# EAGLE design power_distribution (EAGLE 8.0.0)
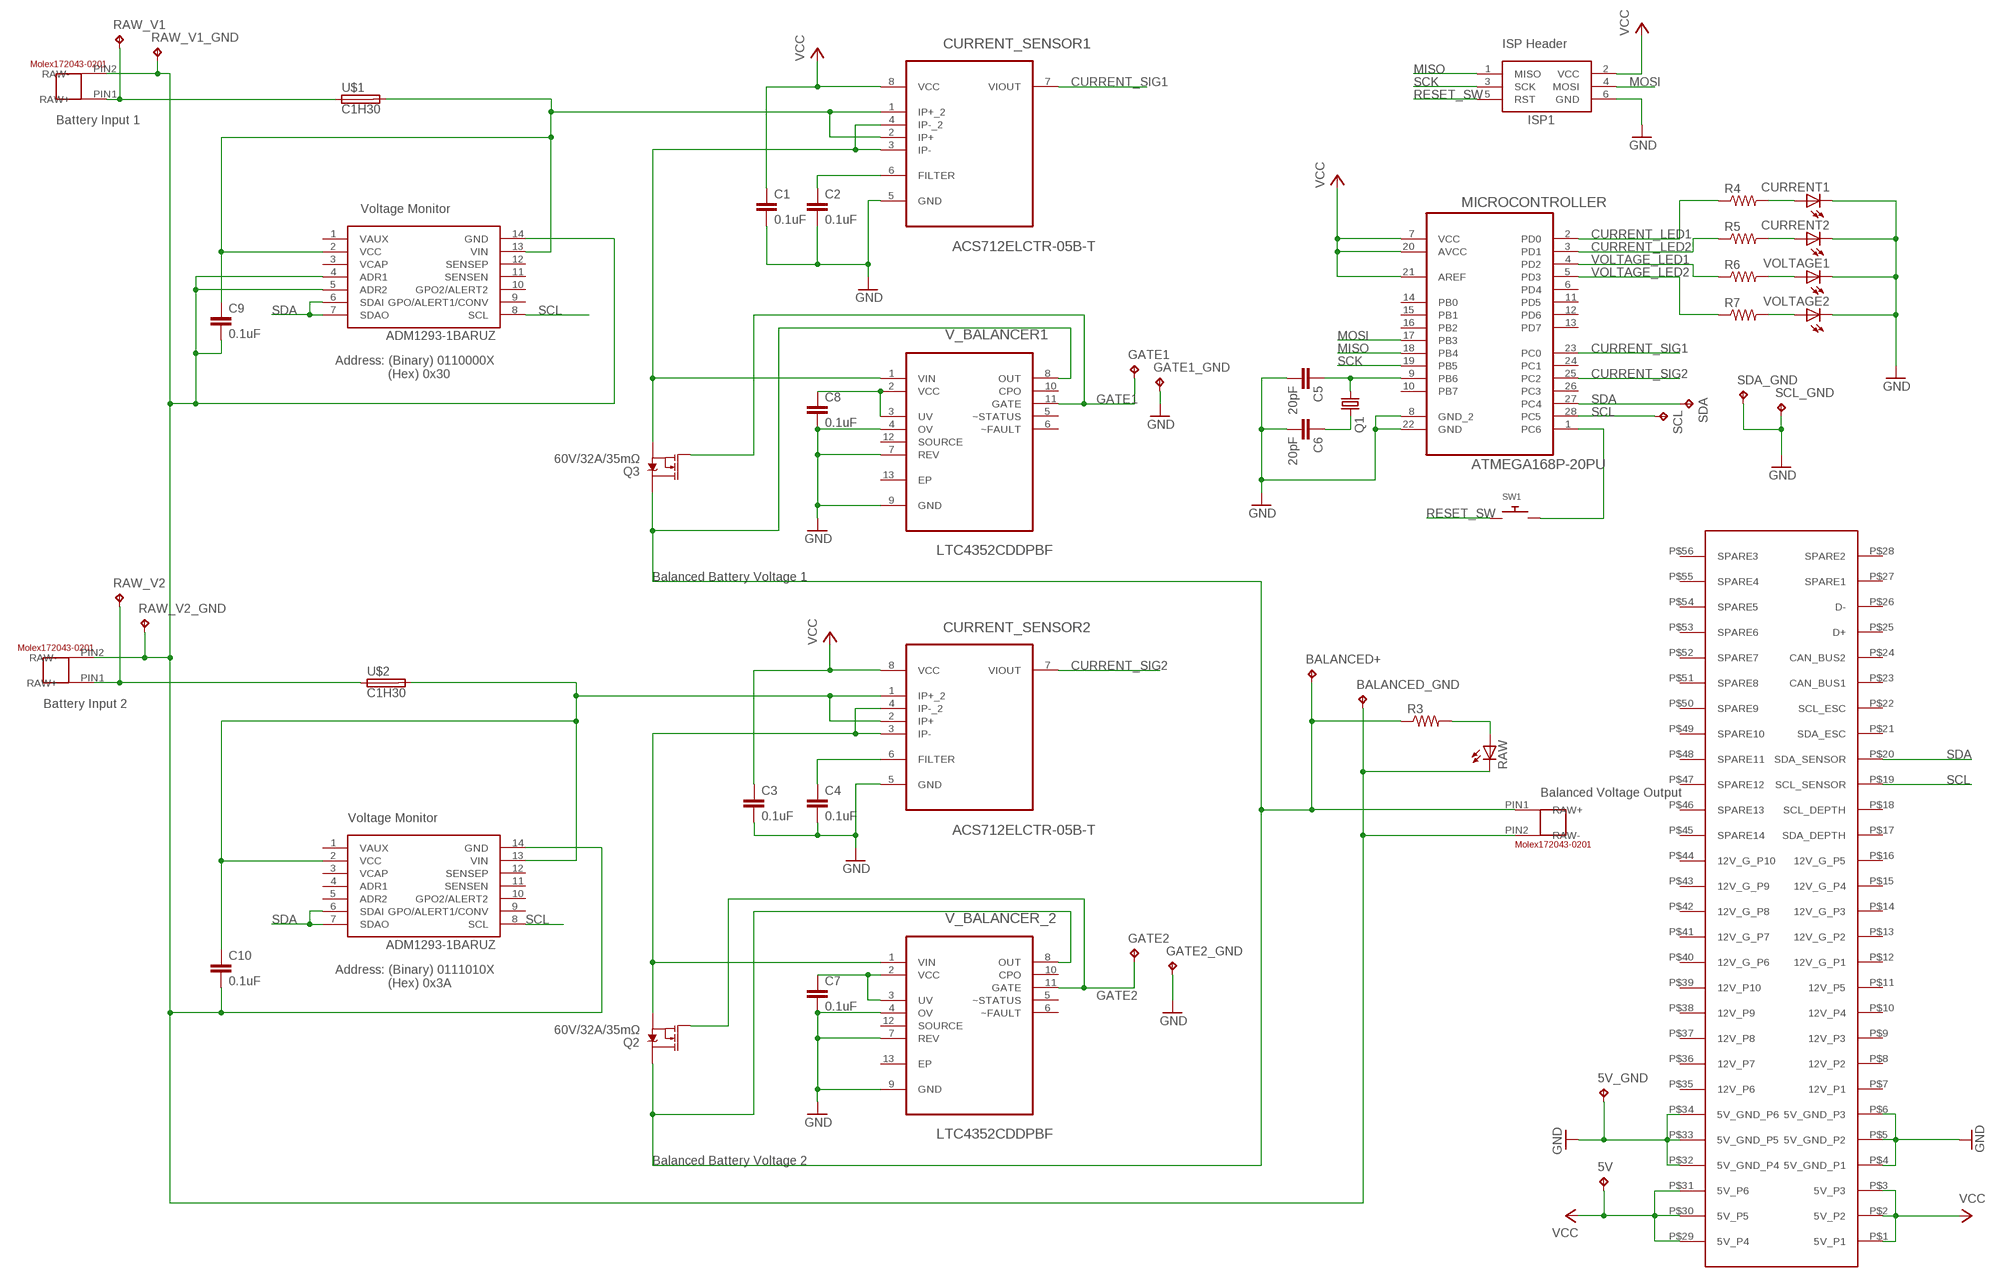
[diagram p0: schematic, sheet 1]

## Parts
5V  TPPAD1-13  [P1-13]
5V_GND  TPPAD1-13  [P1-13]
BALANCED+  TPPAD1-13  [P1-13]
BALANCED_GND  TPPAD1-13  [P1-13]
C1  0.1uF  0.1UF-KIT-EZ-50V-20%  [CAP-PTH-SMALL-KIT]
C2  0.1uF  0.1UF-KIT-EZ-50V-20%  [CAP-PTH-SMALL-KIT]
C3  0.1uF  0.1UF-KIT-EZ-50V-20%  [CAP-PTH-SMALL-KIT]
C4  0.1uF  0.1UF-KIT-EZ-50V-20%  [CAP-PTH-SMALL-KIT]
C5  20pF  0.1UF-KIT-EZ-50V-20%  [CAP-PTH-SMALL-KIT]
C6  20pF  0.1UF-KIT-EZ-50V-20%  [CAP-PTH-SMALL-KIT]
C7  0.1uF  0.1UF-KIT-EZ-50V-20%  [CAP-PTH-SMALL-KIT]
C8  0.1uF  0.1UF-KIT-EZ-50V-20%  [CAP-PTH-SMALL-KIT]
C9  0.1uF  0.1UF-KIT-EZ-50V-20%  [CAP-PTH-SMALL-KIT]
C10  0.1uF  0.1UF-KIT-EZ-50V-20%  [CAP-PTH-SMALL-KIT]
CURRENT1  LED3MM  [LED3MM]
CURRENT2  LED3MM  [LED3MM]
CURRENT_SENSOR1  ACS712ELCTR-05B-T  [SOIC127P600X175-8N]
CURRENT_SENSOR2  ACS712ELCTR-05B-T  [SOIC127P600X175-8N]
GATE1  TPPAD1-13  [P1-13]
GATE1_GND  TPPAD1-13  [P1-13]
GATE2  TPPAD1-13  [P1-13]
GATE2_GND  TPPAD1-13  [P1-13]
INPUT1  MOLEX172043-0201  [MOLEX172043-0201]
INPUT2  MOLEX172043-0201  [MOLEX172043-0201]
ISP1  AVRISP-6  [AVRISP]
MICROCONTROLLER  ATMEGA168P-20PU  [DIP254P762X457-28]
OUTPUT  MOLEX172043-0201  [MOLEX172043-0201]
Q1  CRYSTALHC49U-V  [HC49U-V]
Q2  60V/32A/35mΩ  MOSFET-NCH-FQP30N06L  [TO220V]
Q3  60V/32A/35mΩ  MOSFET-NCH-FQP30N06L  [TO220V]
R3  R-US_0207/12  [0207/12]
R4  R-US_0207/12  [0207/12]
R5  R-US_0207/12  [0207/12]
R6  R-US_0207/12  [0207/12]
R7  R-US_0207/12  [0207/12]
RAW  LED3MM  [LED3MM]
RAW_V1  TPPAD1-13  [P1-13]
RAW_V1_GND  TPPAD1-13  [P1-13]
RAW_V2  TPPAD1-13  [P1-13]
RAW_V2_GND  TPPAD1-13  [P1-13]
SCL  TPPAD1-13  [P1-13]
SCL_GND  TPPAD1-13  [P1-13]
SDA  TPPAD1-13  [P1-13]
SDA_GND  TPPAD1-13  [P1-13]
SW1  SWITCH_PUSHBUTTONEVQ-PE  [TACT_PANA-EVQ]
U$1  C1H30  [C1H30]
U$2  C1H30  [C1H30]
U$3  1-530844-7  [1-530844-7]
U$4  ADM1293  [SOP65P640X120-14N]
U$5  ADM1293  [SOP65P640X120-14N]
V_BALANCER1  LTC4352CDDPBF  [DFN300X300X80-13N]
V_BALANCER_2  LTC4352CDDPBF  [DFN300X300X80-13N]
VOLTAGE1  LED3MM  [LED3MM]
VOLTAGE2  LED3MM  [LED3MM]

## Nets
CURRENT_LED1: MICROCONTROLLER.2(PD0) R4.1
CURRENT_LED2: MICROCONTROLLER.3(PD1) R5.1
CURRENT_SIG1: CURRENT_SENSOR1.7(VIOUT) MICROCONTROLLER.23(PC0)
CURRENT_SIG2: CURRENT_SENSOR2.7(VIOUT) MICROCONTROLLER.25(PC2)
GATE1: GATE1.TP Q3.1(G) V_BALANCER1.11(GATE)
GATE2: GATE2.TP Q2.1(G) V_BALANCER_2.11(GATE)
GND: 5V_GND.TP C1.2 C2.2 C3.2 C4.2 C5.2 C6.2 C7.2 C8.2 CURRENT1.K(C) CURRENT2.K(C) CURRENT_SENSOR1.5(GND) CURRENT_SENSOR2.5(GND) GATE1_GND.TP GATE2_GND.TP ISP1.6(GND) MICROCONTROLLER.8(GND_2) MICROCONTROLLER.22(GND) SCL_GND.TP SDA_GND.TP U$3.P$4(5V_GND_P1) U$3.P$5(5V_GND_P2) U$3.P$6(5V_GND_P3) U$3.P$32(5V_GND_P4) U$3.P$33(5V_GND_P5) U$3.P$34(5V_GND_P6) V_BALANCER1.4(OV) V_BALANCER1.7(REV) V_BALANCER1.9(GND) V_BALANCER_2.4(OV) V_BALANCER_2.7(REV) V_BALANCER_2.9(GND) VOLTAGE1.K(C) VOLTAGE2.K(C)
MISO: ISP1.1(MISO) MICROCONTROLLER.18(PB4)
MOSI: ISP1.4(MOSI) MICROCONTROLLER.17(PB3)
N$1: C9.1 CURRENT_SENSOR1.1(IP+_2) CURRENT_SENSOR1.2(IP+) U$1.P$2 U$4.2(VCC) U$4.13(VIN)
N$2: C5.1 MICROCONTROLLER.9(PB6) Q1.1
N$3: C7.1 V_BALANCER_2.2(VCC) V_BALANCER_2.3(UV)
N$4: C6.1 Q1.2
N$5: CURRENT_SENSOR1.3(IP-) CURRENT_SENSOR1.4(IP-_2) Q3.3(S) V_BALANCER1.1(VIN)
N$7: CURRENT1.A R4.2
N$8: R3.2 RAW.A
N$9: C8.1 V_BALANCER1.2(VCC) V_BALANCER1.3(UV)
N$10: INPUT1.PIN1(RAW+) RAW_V1.TP U$1.P$1
N$11: C10.1 CURRENT_SENSOR2.1(IP+_2) CURRENT_SENSOR2.2(IP+) U$2.P$2 U$5.2(VCC) U$5.13(VIN)
N$13: CURRENT2.A R5.2
N$14: C2.1 CURRENT_SENSOR1.6(FILTER)
N$15: R6.2 VOLTAGE1.A
N$16: INPUT2.PIN1(RAW+) RAW_V2.TP U$2.P$1
N$17: R7.2 VOLTAGE2.A
N$18: C4.1 CURRENT_SENSOR2.6(FILTER)
N$19: BALANCED_GND.TP C9.2 C10.2 INPUT1.PIN2(RAW-) INPUT2.PIN2(RAW-) OUTPUT.PIN2(RAW-) RAW.K(C) RAW_V1_GND.TP RAW_V2_GND.TP U$4.4(ADR1) U$4.5(ADR2) U$4.14(GND) U$5.14(GND)
N$26: BALANCED+.TP OUTPUT.PIN1(RAW+) Q2.2(D) Q3.2(D) R3.1 V_BALANCER1.8(OUT) V_BALANCER_2.8(OUT)
N$27: MICROCONTROLLER.1(PC6) SW1.P$2
RESET_SW: ISP1.5(RST) SW1.P$1
SCK: ISP1.3(SCK) MICROCONTROLLER.19(PB5)
SCL: MICROCONTROLLER.28(PC5) SCL.TP U$3.P$19(SCL_SENSOR) U$4.8(SCL) U$5.8(SCL)
SDA: MICROCONTROLLER.27(PC4) SDA.TP U$3.P$20(SDA_SENSOR) U$4.6(SDAI) U$4.7(SDAO) U$5.6(SDAI) U$5.7(SDAO)
VCC: 5V.TP C1.1 C3.1 CURRENT_SENSOR1.8(VCC) CURRENT_SENSOR2.8(VCC) ISP1.2(VCC) MICROCONTROLLER.7(VCC) MICROCONTROLLER.20(AVCC) MICROCONTROLLER.21(AREF) U$3.P$1(5V_P1) U$3.P$2(5V_P2) U$3.P$3(5V_P3) U$3.P$29(5V_P4) U$3.P$30(5V_P5) U$3.P$31(5V_P6)
VOLTAGE_IN2: CURRENT_SENSOR2.3(IP-) CURRENT_SENSOR2.4(IP-_2) Q2.3(S) V_BALANCER_2.1(VIN)
VOLTAGE_LED1: MICROCONTROLLER.4(PD2) R6.1
VOLTAGE_LED2: MICROCONTROLLER.5(PD3) R7.1
Unconnected: MICROCONTROLLER.6(PD4) MICROCONTROLLER.10(PB7) MICROCONTROLLER.11(PD5) MICROCONTROLLER.12(PD6) MICROCONTROLLER.13(PD7) MICROCONTROLLER.14(PB0) MICROCONTROLLER.15(PB1) MICROCONTROLLER.16(PB2) MICROCONTROLLER.24(PC1) MICROCONTROLLER.26(PC3) U$3.P$7(12V_P1) U$3.P$8(12V_P2) U$3.P$9(12V_P3) U$3.P$10(12V_P4) U$3.P$11(12V_P5) U$3.P$12(12V_G_P1) U$3.P$13(12V_G_P2) U$3.P$14(12V_G_P3) U$3.P$15(12V_G_P4) U$3.P$16(12V_G_P5) U$3.P$17(SDA_DEPTH) U$3.P$18(SCL_DEPTH) U$3.P$21(SDA_ESC) U$3.P$22(SCL_ESC) U$3.P$23(CAN_BUS1) U$3.P$24(CAN_BUS2) U$3.P$25(D+) U$3.P$26(D-) U$3.P$27(SPARE1) U$3.P$28(SPARE2) U$3.P$35(12V_P6) U$3.P$36(12V_P7) U$3.P$37(12V_P8) U$3.P$38(12V_P9) U$3.P$39(12V_P10) U$3.P$40(12V_G_P6) U$3.P$41(12V_G_P7) U$3.P$42(12V_G_P8) U$3.P$43(12V_G_P9) U$3.P$44(12V_G_P10) U$3.P$45(SPARE14) U$3.P$46(SPARE13) U$3.P$47(SPARE12) U$3.P$48(SPARE11) U$3.P$49(SPARE10) U$3.P$50(SPARE9) U$3.P$51(SPARE8) U$3.P$52(SPARE7) U$3.P$53(SPARE6) U$3.P$54(SPARE5) U$3.P$55(SPARE4) U$3.P$56(SPARE3) U$4.1(VAUX) U$4.3(VCAP) U$4.9(GPO/ALERT1/CONV) U$4.10(GPO2/ALERT2) U$4.11(SENSEN) U$4.12(SENSEP) U$5.1(VAUX) U$5.3(VCAP) U$5.4(ADR1) U$5.5(ADR2) U$5.9(GPO/ALERT1/CONV) U$5.10(GPO2/ALERT2) U$5.11(SENSEN) U$5.12(SENSEP) V_BALANCER1.5(~STATUS) V_BALANCER1.6(~FAULT) V_BALANCER1.10(CPO) V_BALANCER1.12(SOURCE) V_BALANCER1.13(EP) V_BALANCER_2.5(~STATUS) V_BALANCER_2.6(~FAULT) V_BALANCER_2.10(CPO) V_BALANCER_2.12(SOURCE) V_BALANCER_2.13(EP)

## Notes on the sheet
- ISP Header
- Battery Input 1
- Voltage Monitor
- ADM1293-1BARUZ
- Address: (Binary) 0110000X
                 (Hex) 0x30
- Balanced Battery Voltage 1
- Battery Input 2
- Balanced Voltage Output
- Voltage Monitor
- ADM1293-1BARUZ
- Address: (Binary) 0111010X
                 (Hex) 0x3A
- Balanced Battery Voltage 2

## Library data of the parts
5V 5V_GND BALANCED+ BALANCED_GND GATE1 GATE1_GND GATE2 GATE2_GND RAW_V1 RAW_V1_GND RAW_V2 RAW_V2_GND SCL SCL_GND SDA SDA_GND = testpad:TP: Test pad
C1-C4 C7-C10 = SparkFun-Capacitors:0.1UF: 0.1µF ceramic capacitors A capacitor is a passive two-terminal electrical component used to store electrical energy temporarily in an electric field.; PROD_ID: CAP-08370
C5 C6 = SparkFun-Capacitors:0.1UF: 0.1µF ceramic capacitors A capacitor is a passive two-terminal electrical component used to store electrical energy temporarily in an electric field.; PROD_ID: CAP-08370; VALUE: 0.1uF
CURRENT1 CURRENT2 RAW VOLTAGE1 VOLTAGE2 = led:LED: LED OSRAM: - CHIPLED LG R971, LG N971, LY N971, LG Q971, LY Q971, LO R971, LY R971 LH N974, LH R974 LS Q976, LO Q976, LY Q976 LO Q996 - Hyper CHIPLED LW Q18S LB Q993, LB Q99A, LB R99A - SideLED LS A670, LO A670, LY A670, LG A670, LP A670 LB A673, LV A673, LT A673, LW A673 LH A674 LY A675 LS A676, LA A676, LO A676, LY A676, LW A676 LS A679, LY A679, LG A679 - Hyper Micro SIDELED® LS Y876, LA Y876, LO Y876, LY Y876 LT Y87S - SmartLED LW L88C, LW L88S LB L89C, LB L89S, LG L890 LS L89K, LO L89K, LY L89K LS L896, LA L896, LO L896, LY L896 - TOPLED LS T670, LO T670, LY T670, LG T670, LP T670 LSG T670, LSP T670, LSY T670, LOP T670, LYG T670 LG T671, LOG T671, LSG T671 LB T673, LV T673, LT T673, LW T673 LH T674 LS T676, LA T676, LO T676, LY T676, LB T676, LH T676, LSB T676, LW T676 LB T67C, LV T67C, LT T67C, LS T67K, LO T67K, LY T67K, LW E67C LS E67B, LA E67B, LO E67B, LY E67B, LB E67C, LV E67C, LT E67C LW T67C LS T679, LY T679, LG T679 LS T770, LO T770, LY T770, LG T770, LP T770 LB T773, LV T773, LT T773, LW T773 LH T774 LS E675, LA E675, LY E675, LS T675 LS T776, LA T776, LO T776, LY T776, LB T776 LHGB T686 LT T68C, LB T68C - Hyper Mini TOPLED® LB M676 - Mini TOPLED Santana® LG M470 LS M47K, LO M47K, LY M47K Source: http://www.osram.convergy.de LUXEON: - LUMILED® LXK2-PW12-R00, LXK2-PW12-S00, LXK2-PW14-U00, LXK2-PW14-V00 LXK2-PM12-R00, LXK2-PM12-S00, LXK2-PM14-U00 LXK2-PE12-Q00, LXK2-PE12-R00, LXK2-PE12-S00, LXK2-PE14-T00, LXK2-PE14-U00 LXK2-PB12-K00, LXK2-PB12-L00, LXK2-PB12-M00, LXK2-PB14-N00, LXK2-PB14-P00, LXK2-PB14-Q00 LXK2-PR12-L00, LXK2-PR12-M00, LXK2-PR14-Q00, LXK2-PR14-R00 LXK2-PD12-Q00, LXK2-PD12-R00, LXK2-PD12-S00 LXK2-PH12-R00, LXK2-PH12-S00 LXK2-PL12-P00, LXK2-PL12-Q00, LXK2-PL12-R00 Source: www.luxeon.com KINGBRIGHT: KA-3528ASYC Source: www.kingbright.com
CURRENT_SENSOR1 CURRENT_SENSOR2 = Allegro_By_element14_Batch_1:ACS712ELCTR-05B-T: Linear Current Sensor; MPN: ACS712ELCTR-05B-T; OC_FARNELL: 1329623; OC_NEWARK: 27M3644; PACKAGE: SOIC-8; SUPPLIER: Allegro
INPUT1 INPUT2 OUTPUT = Molex172043-0201:MOLEX172043-0201
ISP1 = adafruit:AVRISP: AVR ISP HEADER Standard 6 pin header for AVR programming
MICROCONTROLLER = Atmel_By_element14_Batch_1-00:ATMEGA168P-20PU: 8-bit Microcontroller with In-System Programmable Flash; MPN: ATMEGA168P-20PU; OC_FARNELL: 1636933; OC_NEWARK: 03P2021; PACKAGE: PDIP-28; SUPPLIER: Atmel
Q1 = crystal:CRYSTAL: CRYSTAL; OC_FARNELL: 1666969; OC_NEWARK: unknown
Q2 Q3 = SparkFun-DiscreteSemi:MOSFET-NCH: N-channel MOSFETs Voltage controlled devices that allow control of high current outputs. SparkFun Products: SparkFun OpenScale <https://www.sparkfun.com/products/13261> SparkFun Digital Sandbox <https://www.sparkfun.com/products/12651> SparkFun Monster Moto Shield <https://www.sparkfun.com/products/10182> SparkFun MOSFET Power Controller <https://www.sparkfun.com/products/11214>; PROD_ID: TRANS-10060
R3-R7 = resistor:R-US_: RESISTOR, American symbol
SW1 = adafruit:SWITCH_PUSHBUTTON: Buttons SOFTTOUCHSMD_SJ - Soft touch temporary push button (Super Junk Akihabara) Compatible with SKPMANE010 [Mouser: 688-SKPMAN] C&K_KSS = Digikey: KSS221GLFS
U$1 U$2 = fuse:C1H30
U$3 = 1-530844-7-PCBEDGE:1-530844-7
U$4 U$5 = Analog Devices_By_element14_Batch_1:ADM1293
V_BALANCER1 V_BALANCER_2 = LTC_By_element14_Batch_1:LTC4352CDDPBF: Low Voltage Ideal Diode Controller with Monitoring; MPN: LTC4352CDD#PBF; OC_FARNELL: 1647756; OC_NEWARK: 02P7606; PACKAGE: DFN-12; SUPPLIER: Linear Technology

## Board
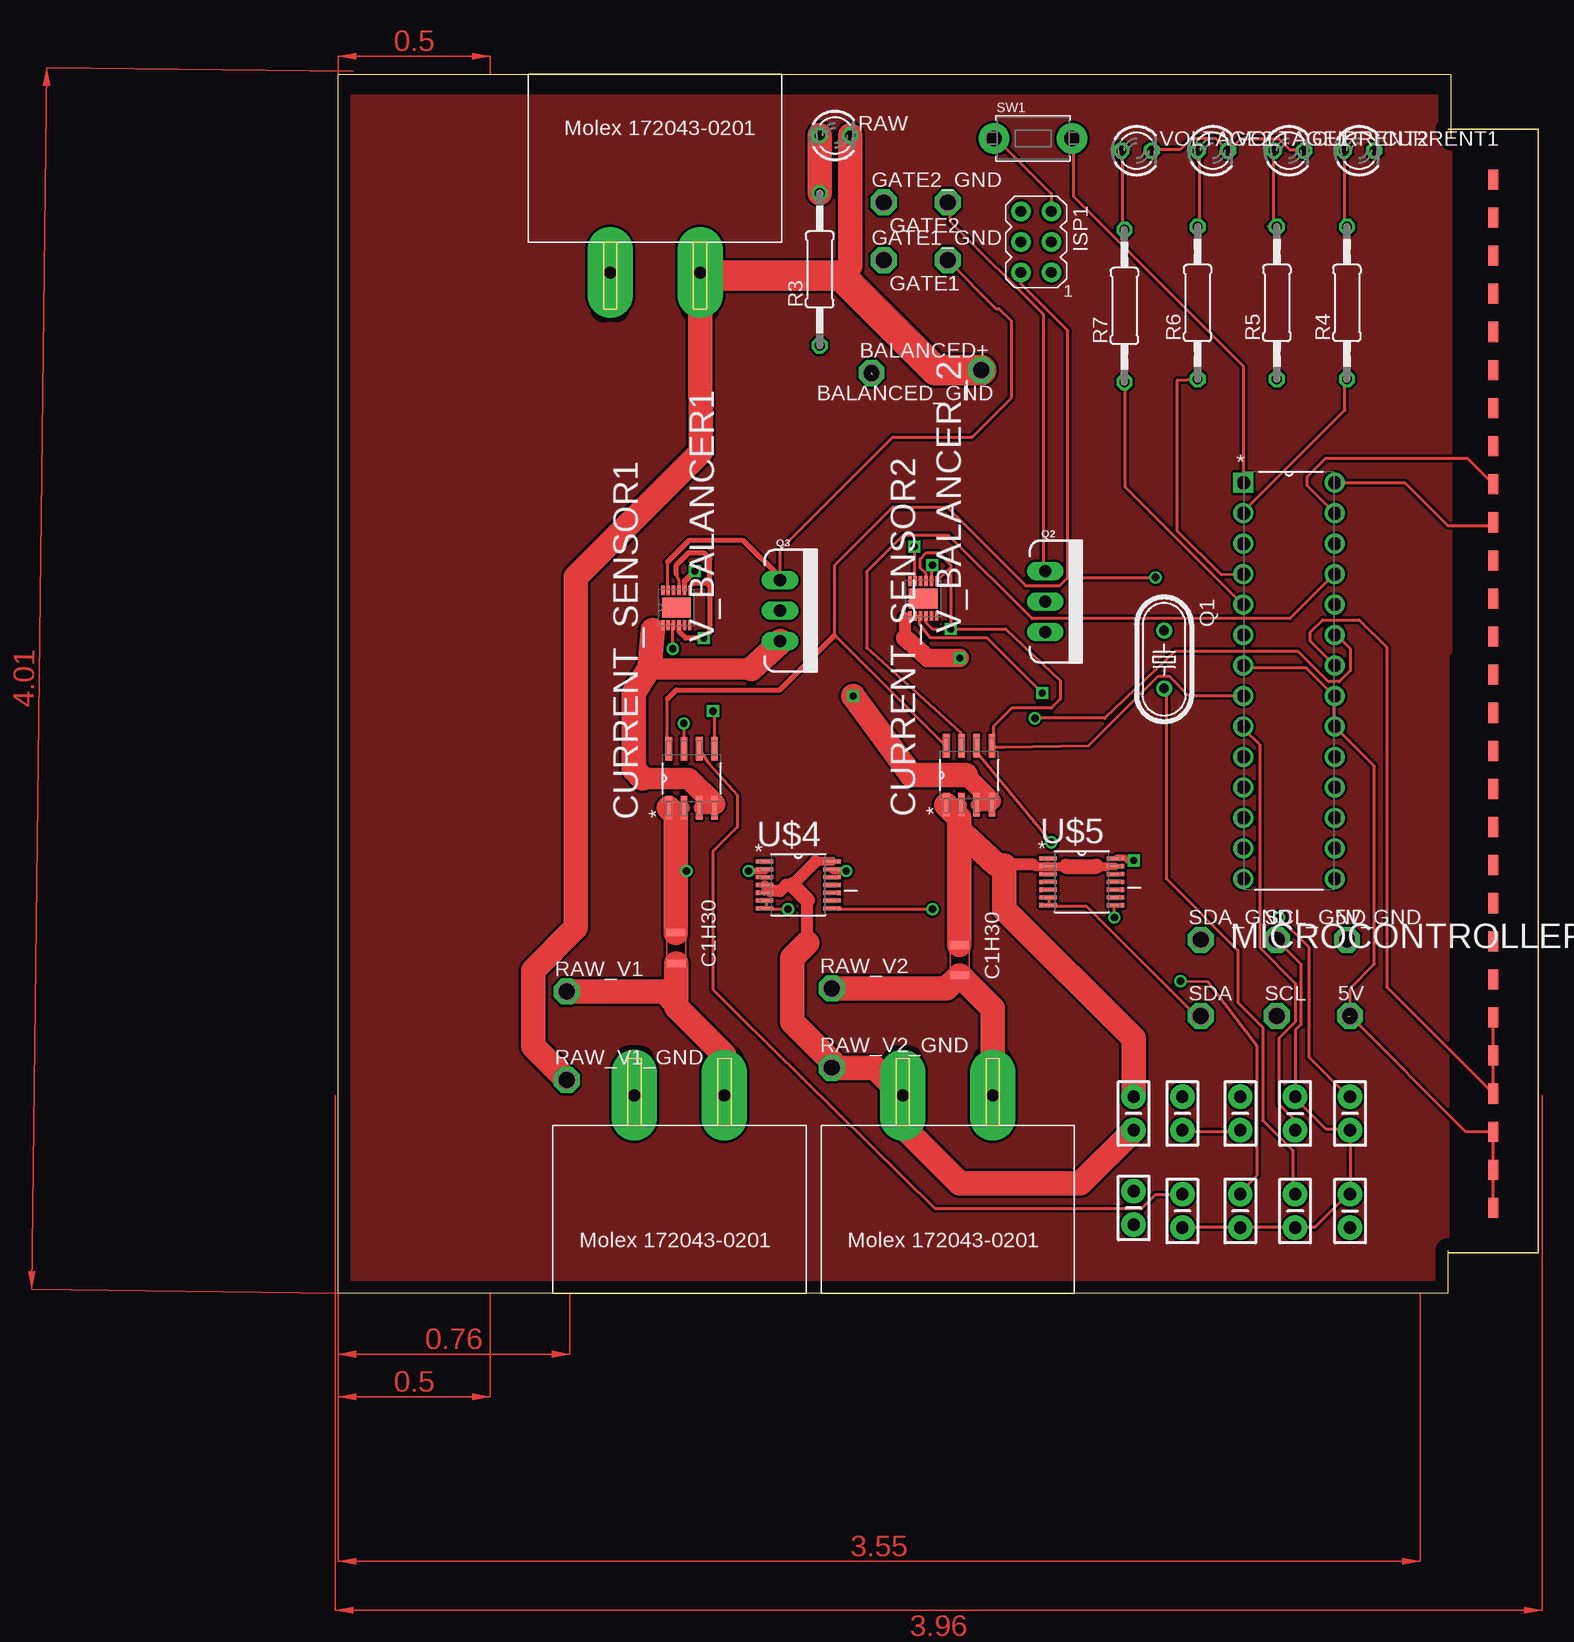
[diagram p1: board, top side]
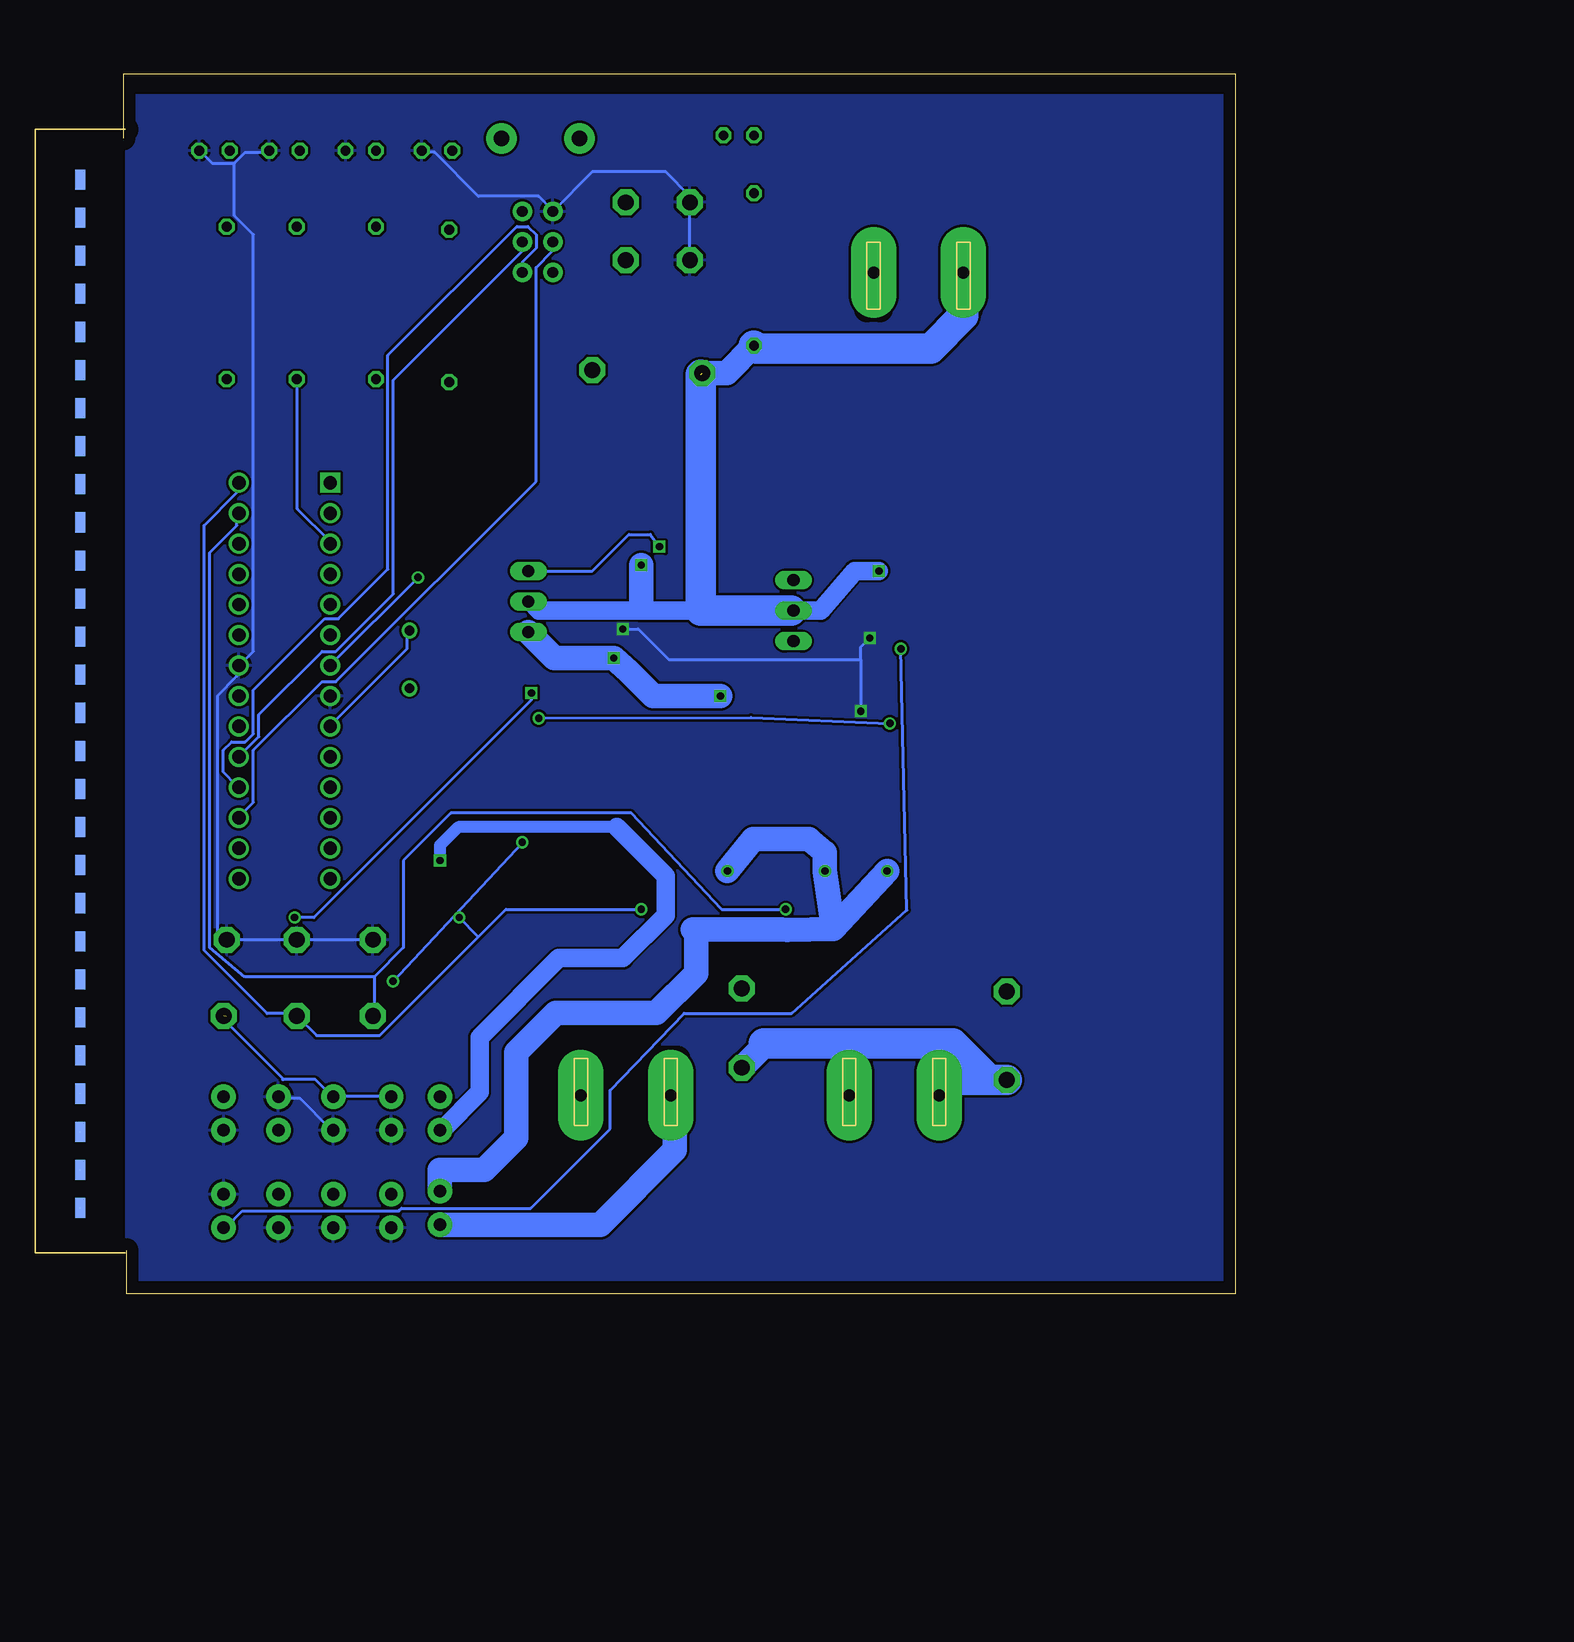
[diagram p2: board, bottom side, seen from below]

Size 100.01 x 101.6 mm. Coordinates in mm from the lower left corner, seen from the top.
Outline: 92.46,3.56 92.46,0 0,0 0,101.6 92.71,101.6 92.71,96.27
Copper layers (1*16): Top 0.035mm / dielectric 1.5mm / Bottom 0.035mm
Design rules "default": minimum track width 10mil, minimum drill 24mil, track to track 8mil, track to pad 8mil, pad to pad 8mil, via to via 8mil, smd to smd 8mil, copper to edge 40mil, drill to drill 8mil, minimum pad ring 10mil, minimum via ring 8mil, stop-mask expansion 4mil, vias tented up to drill 0mil, thermal gap 10mil

### Footprints (pad centres in the part's own frame; a part is rotated, then mirrored left to right if it is on the bottom)
P1-13 = drill 1.321 pad 2.159 octagon: TP 0,0
CAP-PTH-SMALL-KIT = drill 1.016 pad 2.032: 1 -1.397,0; 2 1.397,0
LED3MM = drill 0.813 octagon: A -1.27,0; K 1.27,0
SOIC127P600X175-8N = smd 1.981 x 0.559: 1 -2.464,1.905; 2 -2.464,0.635; 3 -2.464,-0.635; 4 -2.464,-1.905; 5 2.464,-1.905; 6 2.464,-0.635; 7 2.464,0.635; 8 2.464,1.905
MOLEX172043-0201 = drill 1 pad 3.81 long: PIN1 -3.747,-2.54; PIN2 3.747,-2.54
AVRISP = drill 0.9 pad 1.626: 1 -1.27,2.54; 2 1.27,2.54; 3 -1.27,0; 4 1.27,0; 5 -1.27,-2.54; 6 1.27,-2.54
DIP254P762X457-28 = drill 1.118 square: 1 -7.62,33.02 | drill 1.118: 2 -7.62,30.48; 3 -7.62,27.94; 4 -7.62,25.4; 5 -7.62,22.86; 6 -7.62,20.32; 7 -7.62,17.78; 8 -7.62,15.24; 9 -7.62,12.7; 10 -7.62,10.16; 11 -7.62,7.62; 12 -7.62,5.08; 13 -7.62,2.54; 14 -7.62,0; 15 0,0; 16 0,2.54; 17 0,5.08; 18 0,7.62; 19 0,10.16; 20 0,12.7; 21 0,15.24; 22 0,17.78; 23 0,20.32; 24 0,22.86; 25 0,25.4; 26 0,27.94; 27 0,30.48; 28 0,33.02
HC49U-V = drill 0.813: 1 -2.413,0; 2 2.413,0
TO220V = drill 1.016 long: 1 -2.54,0; 2 0,0; 3 2.54,0
0207/12 = drill 0.813 octagon: 1 -6.35,0; 2 6.35,0
TACT_PANA-EVQ = drill 1.3 pad 2.54: P$1 -3.25,0; P$2 3.25,0
C1H30 = smd 0.635 x 1.575: P$1 0.33,0.787; P$2 2.87,0.813
1-530844-7 = smd 1.676 x 0.813: P$1 0,0; P$2 3.175,0; P$3 6.35,0; P$4 9.525,0; P$5 12.7,0; P$6 15.875,0; P$7 19.05,0; P$8 22.225,0; P$9 25.4,0; P$10 28.575,0; P$11 31.75,0; P$12 34.925,0; P$13 38.1,0; P$14 41.275,0; P$15 44.45,0; P$16 47.625,0; P$17 50.8,0; P$18 53.975,0; P$19 57.15,0; P$20 60.325,0; P$21 63.5,0; P$22 66.675,0; P$23 69.85,0; P$24 73.025,0; P$25 76.2,0; P$26 79.375,0; P$27 82.55,0; P$28 85.725,0 | smd 1.676 x 0.813 bottom: P$29 0,0; P$30 3.175,0; P$31 6.35,0; P$32 9.525,0; P$33 12.7,0; P$34 15.875,0; P$35 19.05,0; P$36 22.225,0; P$37 25.4,0; P$38 28.575,0; P$39 31.75,0; P$40 34.925,0; P$41 38.1,0; P$42 41.275,0; P$43 44.45,0; P$44 47.625,0; P$45 50.8,0; P$46 53.975,0; P$47 57.15,0; P$48 60.325,0; P$49 63.5,0; P$50 66.675,0; P$51 69.85,0; P$52 73.025,0; P$53 76.2,0; P$54 79.375,0; P$55 82.55,0; P$56 85.725,0
SOP65P640X120-14N = smd 1.473 x 0.356: 1 -2.819,1.956; 2 -2.819,1.295; 3 -2.819,0.66; 4 -2.819,0; 5 -2.819,-0.66; 6 -2.819,-1.295; 7 -2.819,-1.956; 8 2.819,-1.956; 9 2.819,-1.295; 10 2.819,-0.66; 11 2.819,0; 12 2.819,0.66; 13 2.819,1.295; 14 2.819,1.956
DFN300X300X80-13N = smd 0.813 x 0.279: 1 -1.448,1.118; 2 -1.448,0.686; 3 -1.448,0.229; 4 -1.448,-0.229; 5 -1.448,-0.686; 6 -1.448,-1.118; 7 1.448,-1.118; 8 1.448,-0.686; 9 1.448,-0.229; 10 1.448,0.229; 11 1.448,0.686; 12 1.448,1.118 | smd 1.651 x 2.388: 13 0,0

### Placement (x,y rotation side)
5V  84.33,23.11 0 top
5V_GND  84.07,29.46 0 top
BALANCED+  44.45,76.71 0 top
BALANCED_GND  53.59,76.96 180 top
C1  70.36,14.99 270 top
C2  70.36,6.86 270 top
C3  75.18,14.99 270 top
C4  75.18,6.86 270 top
C5  79.76,14.99 90 top
C6  79.76,6.86 270 top
C7  84.33,14.99 270 top
C8  84.33,6.86 90 top
C9  66.29,7.11 270 top
C10  66.29,14.99 270 top
CURRENT1  85.09,95.25 0 top
CURRENT2  79.25,95.25 0 top
CURRENT_SENSOR1  29.46,42.93 90 top
CURRENT_SENSOR2  52.58,43.18 90 top
GATE1  50.8,86.11 180 top
GATE1_GND  45.47,86.11 0 top
GATE2  50.8,90.93 180 top
GATE2_GND  45.47,90.93 0 top
INPUT1  28.45,13.97 180 top
INPUT2  50.8,13.97 180 top
ISP1  58.17,87.63 180 top
MICROCONTROLLER  83.06,34.54 0 top
OUTPUT  26.42,87.63 0 top
Q1  68.83,52.83 270 top
Q2  58.93,57.66 270 top
Q3  36.83,56.9 270 top
R3  40.13,85.34 90 top
R4  84.07,82.55 90 top
R5  78.23,82.55 90 top
R6  71.63,82.55 90 top
R7  65.53,82.3 90 top
RAW  41.4,96.52 0 top
RAW_V1  19.05,25.15 0 top
RAW_V1_GND  19.05,17.78 0 top
RAW_V2  41.15,25.4 0 top
RAW_V2_GND  41.15,18.8 0 top
SCL  78.23,23.11 0 top
SCL_GND  78.23,29.46 0 top
SDA  71.88,23.11 0 top
SDA_GND  71.88,29.46 0 top
SW1  57.91,96.27 0 top
U$1  28.96,27.18 90 top
U$2  52.58,26.16 90 top
U$3  96.27,7.11 90 top
U$4  38.35,34.04 0 top
U$5  61.98,34.29 0 top
V_BALANCER1  28.19,57.15 90 top
V_BALANCER_2  48.77,57.91 90 top
VOLTAGE1  72.9,95.25 0 top
VOLTAGE2  66.55,95.25 0 top

### Tracks (layer width: path | path; a pad name or v marks a point on that pad's centre or on a via)
CURRENT_LED1
  Top 0.254: R4.1 83.9,76.12 83.9,73.61 75.44,65.15 MICROCONTROLLER.2
CURRENT_LED2
  Bottom 0.254: R5.1 78.18,76.12 78.18,65.38 75.44,62.64 MICROCONTROLLER.3
CURRENT_SIG1  (via drill 0.61)
  Top 0.254: v28.8,47.5 28.8,45.26 CURRENT_SENSOR1.7 | v58.06,47.93 63.91,47.93 69.72,53.49 80.01,53.49 82.53,50.98 83.44,50.98 84.35,51.89 84.35,53.72 83.21,54.86 MICROCONTROLLER.23
  Bottom 0.254: v28.8,47.5 40.36,48.01 v58.06,47.93
CURRENT_SIG2
  Top 0.254: CURRENT_SENSOR2.7 51.89,45.72 51.89,46.74 44.04,53.82 44.04,60.15 47.07,63.17 50.9,63.17 57.84,56.24 79.32,56.24 82.98,59.89 MICROCONTROLLER.25
GATE1
  Top 0.254: 27.43,60.96 27.43,58.67 V_BALANCER1.11 | Q3.1 36.83,61.98 46.23,71.37 52.83,71.37 56.13,74.68 56.13,81.03 55.12,82.04 54.86,82.04 GATE1.TP
  Top 0.406: Q3.1 36.83,59.69 33.78,62.74 29.21,62.74 27.43,60.96
  Bottom 0.254: 37.03,59.44 Q3.1 | 50.75,85.95 GATE1.TP
GATE2  (via drill 0.6)
  Top 0.254: Q2.1 58.75,60.35 58.75,81.61 50.98,89.38 50.98,90.75 GATE2.TP | v48.01,62.23 48.01,59.44 V_BALANCER_2.11
  Bottom 0.254: Q2.1 53.59,60.2 50.55,63.25 48.77,63.25 v48.01,62.23
GND  (via drill 0.6)  (3 unrouted)
  Top 0.254: VOLTAGE2.K 67.89,95.33 70.18,95.33 71.09,96.24 73.15,96.24 74.07,95.33 VOLTAGE1.K 74.3,95.33 75.21,96.24 78.41,96.24 79.32,95.33 80.47,95.33 CURRENT2.K | MICROCONTROLLER.8 75.44,49.84 70.87,49.84 69.27,51.44 68.35,51.44 62.53,45.62 55.55,45.49 54.63,45.49 CURRENT_SENSOR2.5 54.61,45.77 54.61,47.24 56.13,48.77 59.44,48.77 60.2,49.53 60.2,51.05 55.63,55.37 v51.05,55.37 50.8,55.37 | 79.88,16.43 C5.2 | 78.18,29.26 SCL_GND.TP 78.41,29.26 80.24,27.43 80.24,22.4 79.78,21.95 79.78,16.46 C5.2 | 70.28,13.69 C1.2 70.41,13.49 74.98,13.49 C3.2 | C2.2 70.41,5.49 74.98,5.49 C4.2 75.21,5.49 79.55,5.49 C6.2 79.78,5.49 81.38,5.49 84.12,8.23 C8.2 84.35,8.46 84.35,13.49 C7.2 84.12,13.72 82.3,13.72 79.78,16.23 C5.2 | V_BALANCER1.9 28.42,59.41 28.19,59.94 | V_BALANCER1.7 29.31,58.78 29.72,59.18 | CURRENT_SENSOR1.5 31.37,48.39 31.5,48.51 v31.24,48.51 | V_BALANCER_2.9 49,59.97 48.51,60.45 48.51,61.21 49.02,61.72 50.04,61.72 51.05,60.71 51.05,60.53 | 51.05,60.53 V_BALANCER_2.7 50.11,59.36 | V_BALANCER_2.4 49.02,56.44 49.02,55.88 49.53,55.37 50.8,55.37 | 51.05,60.53 51.05,55.63 50.8,55.37 | MICROCONTROLLER.22 81.03,54.36 81.03,55.12 82.04,56.13 85.09,56.13 87.38,53.85 87.38,25.53 U$3.P$4 U$3.P$5 U$3.P$6
  Top 0.406: 28.19,59.94 28.19,60.71 29.21,61.72 30.48,61.72 30.99,61.21 30.99,58.93 | 30.99,58.93 30.99,55.12 v30.48,54.61 28.96,54.61 28.45,55.12 28.45,55.68 V_BALANCER1.4 | 29.72,59.18 30.73,59.18 30.99,58.93
  Bottom 0.254: 83.44,94.18 82.53,95.1 80.7,95.1 CURRENT2.K | 83.44,94.18 85.27,94.18 86.18,95.1 CURRENT1.K | VOLTAGE2.K 67.67,95.1 66.75,95.1 63.09,91.44 58.06,91.44 56.92,90.3 ISP1.6 53.59,93.47 47.5,93.47 45.47,91.44 GATE2_GND.TP GATE1_GND.TP | 75.31,13.69 C3.2 75.44,13.72 77.95,16.23 79.55,16.23 C5.2 79.65,16.2 | 84.12,29.49 84.81,30.18 84.81,49.84 83.21,51.44 83.21,52.12 MICROCONTROLLER.22 82.98,52.35 81.84,53.49 81.84,88.24 83.44,89.84 83.44,94.18 | 83.9,29.49 78.41,29.49 SCL_GND.TP 78.18,29.49 72.01,29.49 SDA_GND.TP | 31.24,52.83 v31.24,48.51 | 31.24,52.83 31.24,53.85 v30.48,54.61 | v51.05,55.37 49.78,55.37 47.24,52.83 31.24,52.83
  pour Bottom: 0.25,99.82 92.46,99.82 92.46,0.25 0,0.25 0,8.38 0.25,8.38 0.25,99.57
MISO
  Bottom 0.254: ISP1.1 59.44,85.95 58.29,87.1 58.29,88.24 58.98,88.92 59.89,88.92 70.64,78.18 70.64,60.35 74.75,56.24 75.89,56.24 81.84,50.29 81.84,46.63 82.53,45.95 83.67,45.95 84.35,45.26 84.35,43.43 83.21,42.29 MICROCONTROLLER.18
MOSI
  Bottom 0.254: ISP1.4 56.92,87.55 56.92,86.87 58.29,85.5 58.29,67.67 74.98,50.98 76.12,50.98 81.84,45.26 81.84,40.92 82.98,39.78 MICROCONTROLLER.17
N$1  (via drill 0.61)
  Top 0.254: 35.66,35.2 U$4.2 | 41.15,35.2 U$4.13 | v29.03,35.2 28.14,35.2
  Top 0.406: 28.14,30.2 U$1.P$2
  Top 0.508: v34.21,35.2 35.66,35.2 | 41.15,35.2 v42.34,35.2
  Top 1.016: CURRENT_SENSOR1.1 CURRENT_SENSOR1.2
  Top 2.032: U$1.P$2 28.14,35.2 28.14,39.88 CURRENT_SENSOR1.1
  Bottom 0.254: 37.34,30.28 37.8,30.33 | 44.96,30.05 45.24,30.33
  Bottom 2.032: v29.03,35.2 33.53,30.38 | 33.53,30.38 v34.21,35.2 34.21,36.75 35.56,37.85 40.21,37.85 v42.34,35.2 | C9.1 66.29,10.29 62.61,10.29 59.94,12.95 59.94,20.07 56.64,23.37 48.26,23.37 44.96,26.67 44.96,30.05 | 45.24,30.33 37.8,30.33 | 33.53,30.38 37.34,30.28
N$2
  Top 0.254: C5.1 79.55,13.72 79.55,14.63 78.41,15.77 78.41,21.26 79.78,22.63 79.78,25.83 76.81,28.8 76.81,45.72 75.44,47.09 MICROCONTROLLER.9
  Bottom 0.254: Q1.1 69.04,55.09 69.04,53.72 75.44,47.32 MICROCONTROLLER.9
N$3  (via drill 0.6, 0.61)
  Top 0.254: v78.41,31.32 80.92,28.8 80.92,19.66 84.12,16.46 C7.1 | V_BALANCER_2.2 V_BALANCER_2.3 48.46,56.46 48.46,55.78 49.35,54.63 54.08,54.63 v58.67,50.04
  Bottom 0.254: v78.41,31.32 76.81,31.32 58.67,49.45 v58.67,50.04
N$4
  Top 0.254: Q1.2 69.04,50.29 69.04,34.52 74.98,28.57 74.98,24.23 77.04,22.17 77.04,14.4 79.55,11.89 79.55,8.46 C6.1
N$5
  Top 0.254: 25.91,52.05 25.96,52.25 | 26.21,55.3 V_BALANCER1.1 | 29.95,40.46 CURRENT_SENSOR1.3
  Top 0.406: CURRENT_SENSOR1.4 31.37,40.77
  Top 1.016: CURRENT_SENSOR1.3 CURRENT_SENSOR1.4
  Top 1.778: 34.42,52.05 25.91,52.05 | 31.37,40.77 29.21,42.93 25.4,42.93
  Top 2.032: 25.96,52.25 26.21,55.3 | 34.42,52.05 36.8,54.18 Q3.3 | 25.4,42.93 24.64,43.69 24.64,50.01 25.91,52.05
N$6
  pour Top: 0.25,99.82 92.71,99.82 92.71,53.34 92.46,53.34 92.46,0 0,0 0,7.87 0.25,7.87
N$7
  Top 0.254: CURRENT1.A 83.9,95.1 83.9,88.92 R4.2
N$8
  Top 2.032: R3.2 RAW.A
N$9  (via drill 0.61)
  Top 0.254: v27.89,53.72 27.89,55.55 V_BALANCER1.3 V_BALANCER1.2
  Bottom 0.254: v27.89,53.72 27.38,31.93 36.98,23.34 45.95,23.34 52.12,16.92 52.12,13.72 58.75,7.09 69.49,7.09 69.72,6.86 82.75,6.86 84.12,5.49 C8.1
N$10
  Top 0.406: 28.19,24.13 28.19,23.88 | 28.19,27.48 U$1.P$1
  Top 2.032: INPUT1.PIN1 32.19,19.88 28.19,23.88 | 28.19,27.48 28.19,24.13 27.18,25.15 RAW_V1.TP
N$11
  Top 0.254: CURRENT_SENSOR2.1 50.75,40.69 | 51.89,40.69 CURRENT_SENSOR2.2 52.12,40.69 52.12,38.23 | 59.21,35.66 U$5.2 | 65.2,35.66 U$5.13 64.77,35.56 | 54.83,35.78 56.46,35.66 55.52,35.66 | 58.98,35.66 U$5.2 | 57.87,35.78 57.91,35.81 | 59.13,35.56 U$5.2
  Top 0.635: 64.01,35.56 64.77,35.56
  Top 0.762: 57.91,35.81 58.17,35.56 59.13,35.56 | U$5.2 60.68,35.59 | 63.22,35.59 64.01,35.56
  Top 1.016: 51.89,40.69 50.75,40.69 | 54.83,35.78 57.87,35.78
  Top 1.27: 60.68,35.59 63.22,35.59
  Top 2.032: 54.83,35.78 52.12,38.23 | C10.1 66.29,21.23 55.52,32 55.52,35.66 | U$2.P$2 51.77,39.62 CURRENT_SENSOR2.1
N$13
  Top 0.254: 77.5,88.92 R5.2 77.95,88.92 77.95,95.1 CURRENT2.A
N$14
  Top 0.254: CURRENT_SENSOR1.6 30.18,45.26 30.94,44.12 33.27,41.53 33.27,38.86 31.24,36.83 31.24,25.32 33.27,23.29 49.73,7.09 66.98,7.09 68.12,8.23 70.18,8.23 C2.1 70.28,8.43
N$15
  Top 0.254: R6.2 71.78,88.92 71.78,95.1 VOLTAGE1.A
N$16
  Top 2.032: INPUT2.PIN1 54.55,23.74 U$2.P$1 50.7,25.4 RAW_V2.TP
N$17
  Top 0.254: VOLTAGE2.A 65.38,95.1 65.38,88.7 R7.2
N$18  (via drill 0.61)
  Top 0.254: v59.44,37.59 53.26,45.03 53.26,45.49 CURRENT_SENSOR2.6 | v70.21,26.01 72.49,25.93 76.58,20.57 76.58,9.83 75.21,8.46 C4.1
  Bottom 0.254: v59.44,37.59 59.38,37.59 v70.21,26.01
N$19  (via drill 0.6)
  Top 0.254: 30.16,74.74 30.23,74.68 | 64.87,36.32 U$5.14
  Top 0.508: U$4.4 U$4.5 | v66.29,36.07 65.79,36.07 65.53,36.32 64.87,36.32
  Top 0.762: U$4.14 39.8,35.99 | 36.04,33.53 U$4.4
  Top 1.016: 39.12,29.21 39.12,32.77 | 39.8,35.99 37.85,34.04 37.34,34.04 36.83,33.53 36.04,33.53
  Top 1.27: 39.12,32.77 37.85,34.04
  Top 2.032: OUTPUT.PIN2 30.16,74.74 | 30.23,74.68 30.23,70.1 19.81,59.69 19.81,30.48 16.26,26.92 16.26,20.57 RAW_V1_GND.TP | RAW.K 42.67,85.6 41.91,84.84 | C10.2 61.85,9.14 51.82,9.14 47.05,13.91 INPUT2.PIN2 44.77,18.8 RAW_V2_GND.TP 41.15,19.3 37.85,22.61 37.85,27.94 39.12,29.21
  Top 2.54: BALANCED_GND.TP 49.78,76.96 41.91,84.84 30.42,84.84 OUTPUT.PIN2
  Bottom 0.254: 20.57,17.83 19.2,17.83 RAW_V1_GND.TP | 39.32,20.8 41.15,18.97 RAW_V2_GND.TP | C10.2 66.17,13.59
  Bottom 0.406: 39.32,20.8 39.32,20.62
  Bottom 1.016: 51.56,38.86 64.77,38.86 66.29,37.34 v66.29,36.07
  Bottom 1.524: 66.17,13.59 62.99,16.76 62.99,21.34 56.39,27.94 51.05,27.94 47.5,31.5 47.5,34.8 51.56,38.86
  Bottom 2.032: 39.32,20.62 RAW_V2_GND.TP | C9.2 52.96,5.71 46.74,11.94 46.74,16.19 INPUT2.PIN2
  Bottom 2.54: 20.57,17.83 23.55,20.8 39.32,20.8 | RAW_V1_GND.TP 23.43,17.78 INPUT1.PIN2
N$26  (via drill 0.6)  (1 unrouted)
  Top 0.254: V_BALANCER_2.8 49.45,60.12 49.53,60.2 v49.53,60.71
  Top 0.406: V_BALANCER1.8 28.88,59.36
  Top 0.508: 28.88,59.36 v29.72,60.2
  Bottom 0.254: Q3.2 37.03,56.92 | 49.53,57.17 49.78,56.92
  Bottom 1.524: 44.58,56.92 49.78,56.92 58.06,56.92 58.75,57.61 Q2.2 | v29.72,60.2 31.75,60.2 34.54,56.9 Q3.2
  Bottom 2.032: v49.53,60.71 49.53,57.17 | BALANCED+.TP 42.42,76.71 R3.1
  Bottom 2.54: 37.03,56.92 44.58,56.92 44.58,76.58 | OUTPUT.PIN1 22.67,81.47 25.4,78.74 39.88,78.74 R3.1
N$27
  Top 0.254: MICROCONTROLLER.1 75.44,77.27 61.27,91.44 61.27,96.24 SW1.P$2
RESET_SW
  Top 0.254: ISP1.5 59.44,91.67 54.86,96.24 SW1.P$1
SCK
  Bottom 0.254: ISP1.3 59.44,86.87 70.18,76.12 70.18,58.29 74.98,53.49 76.12,53.49 81.38,48.23 81.38,46.41 82.98,44.81 MICROCONTROLLER.19
SCL  (via drill 0.61)
  Top 0.254: v49.53,32 41.38,32 U$4.8 | v64.69,31.32 64.69,32.23 U$5.8 | MICROCONTROLLER.28 88.9,67.56 92.46,64.01 96.01,64.01 U$3.P$19
  Bottom 0.254: v49.53,32 60.81,32 63.09,29.72 | 63.09,29.72 71.32,21.49 76.58,21.49 78.18,23.09 SCL.TP 78.41,23.32 80.7,23.32 85.95,28.57 85.95,64.01 83.21,66.75 83.21,67.44 MICROCONTROLLER.28 | 63.09,29.72 v64.69,31.32
SDA  (via drill 0.61)
  Top 0.254: U$5.6 59.21,32.92 59.21,32.46 U$5.7 59.21,32.23 62.41,32.23 71.32,23.32 71.78,23.32 SDA.TP | U$4.6 35.66,32.69 35.66,32.23 U$4.7 35.66,32 v37.49,32 | MICROCONTROLLER.27 80.77,67.31 80.77,68.07 82.3,69.6 94.11,69.6 U$3.P$20
  Bottom 0.254: v37.49,32 42.82,32 50.34,40.03 65.38,40.03 69.34,36.07 69.34,28.8 71.78,26.36 | 71.78,26.36 71.78,23.32 SDA.TP | 71.78,26.36 82.55,26.36 85.5,28.8 85.5,61.72 83.21,64.01 83.21,64.92 MICROCONTROLLER.27
VCC  (via drill 0.61)  (4 unrouted)
  Top 0.254: 27.43,49.58 27.43,45.49 CURRENT_SENSOR1.8 | CURRENT_SENSOR2.8 50.52,45.72 41.38,54.86 41.38,60.68 46.23,65.53 50.75,65.53 57.3,58.98 60.12,58.98 60.81,59.66 | 60.81,59.66 60.81,80.24 56.92,84.12 56.92,85.04 ISP1.2 | MICROCONTROLLER.7 75.44,52.12 80.7,52.12 82.98,49.84 MICROCONTROLLER.21 82.98,49.61 82.98,47.32 MICROCONTROLLER.20 86.36,43.94 86.36,27.43 84.33,25.4 5V.TP 93.98,13.46 U$3.P$3 U$3.P$2 U$3.P$1 | 70.28,16.43 C1.1 | 60.81,59.66 v68.12,59.66
  Top 0.406: 27.43,49.58 27.48,49.58 28.19,50.29 36.8,50.29 41.38,54.86
  Bottom 0.254: C1.1 70.51,16.43 75.08,16.43 C3.1 75.31,16.43 76.68,17.8 79.32,17.8 | 79.32,17.8 79.43,17.8 | 84.12,23.09 84.12,22.63 79.32,17.83 79.32,17.8 | v68.12,59.66 75.44,52.35 MICROCONTROLLER.7
VOLTAGE_IN2  (via drill 0.6)
  Top 0.254: V_BALANCER_2.1 47.55,56.46 47.55,56.08 47.24,56.29 | 53.03,41.15 CURRENT_SENSOR2.3 | CURRENT_SENSOR2.4 54.48,41.02
  Top 1.016: CURRENT_SENSOR2.3 CURRENT_SENSOR2.4 | 47.24,54.61 47.24,56.29
  Top 1.524: v51.82,52.96 49.15,52.96 47.24,54.61 | 54.48,41.02 52.32,43.18
  Top 2.032: 52.32,43.18 47.75,43.18 v42.93,49.78
  Bottom 2.032: v42.93,49.78 48.51,49.78 50.55,51.82 v51.82,52.96 56.77,52.96 Q2.3
VOLTAGE_LED1
  Top 0.254: R6.1 69.95,76.12 69.95,63.55 73.61,59.89 MICROCONTROLLER.4
VOLTAGE_LED2
  Top 0.254: R7.1 65.61,75.89 65.61,67.21 75.44,57.38 MICROCONTROLLER.5
(copper drawn outside any net)
  shapes: Top area x6